# EAGLE design Main_Camera_Board7 (EAGLE 7.7.0)
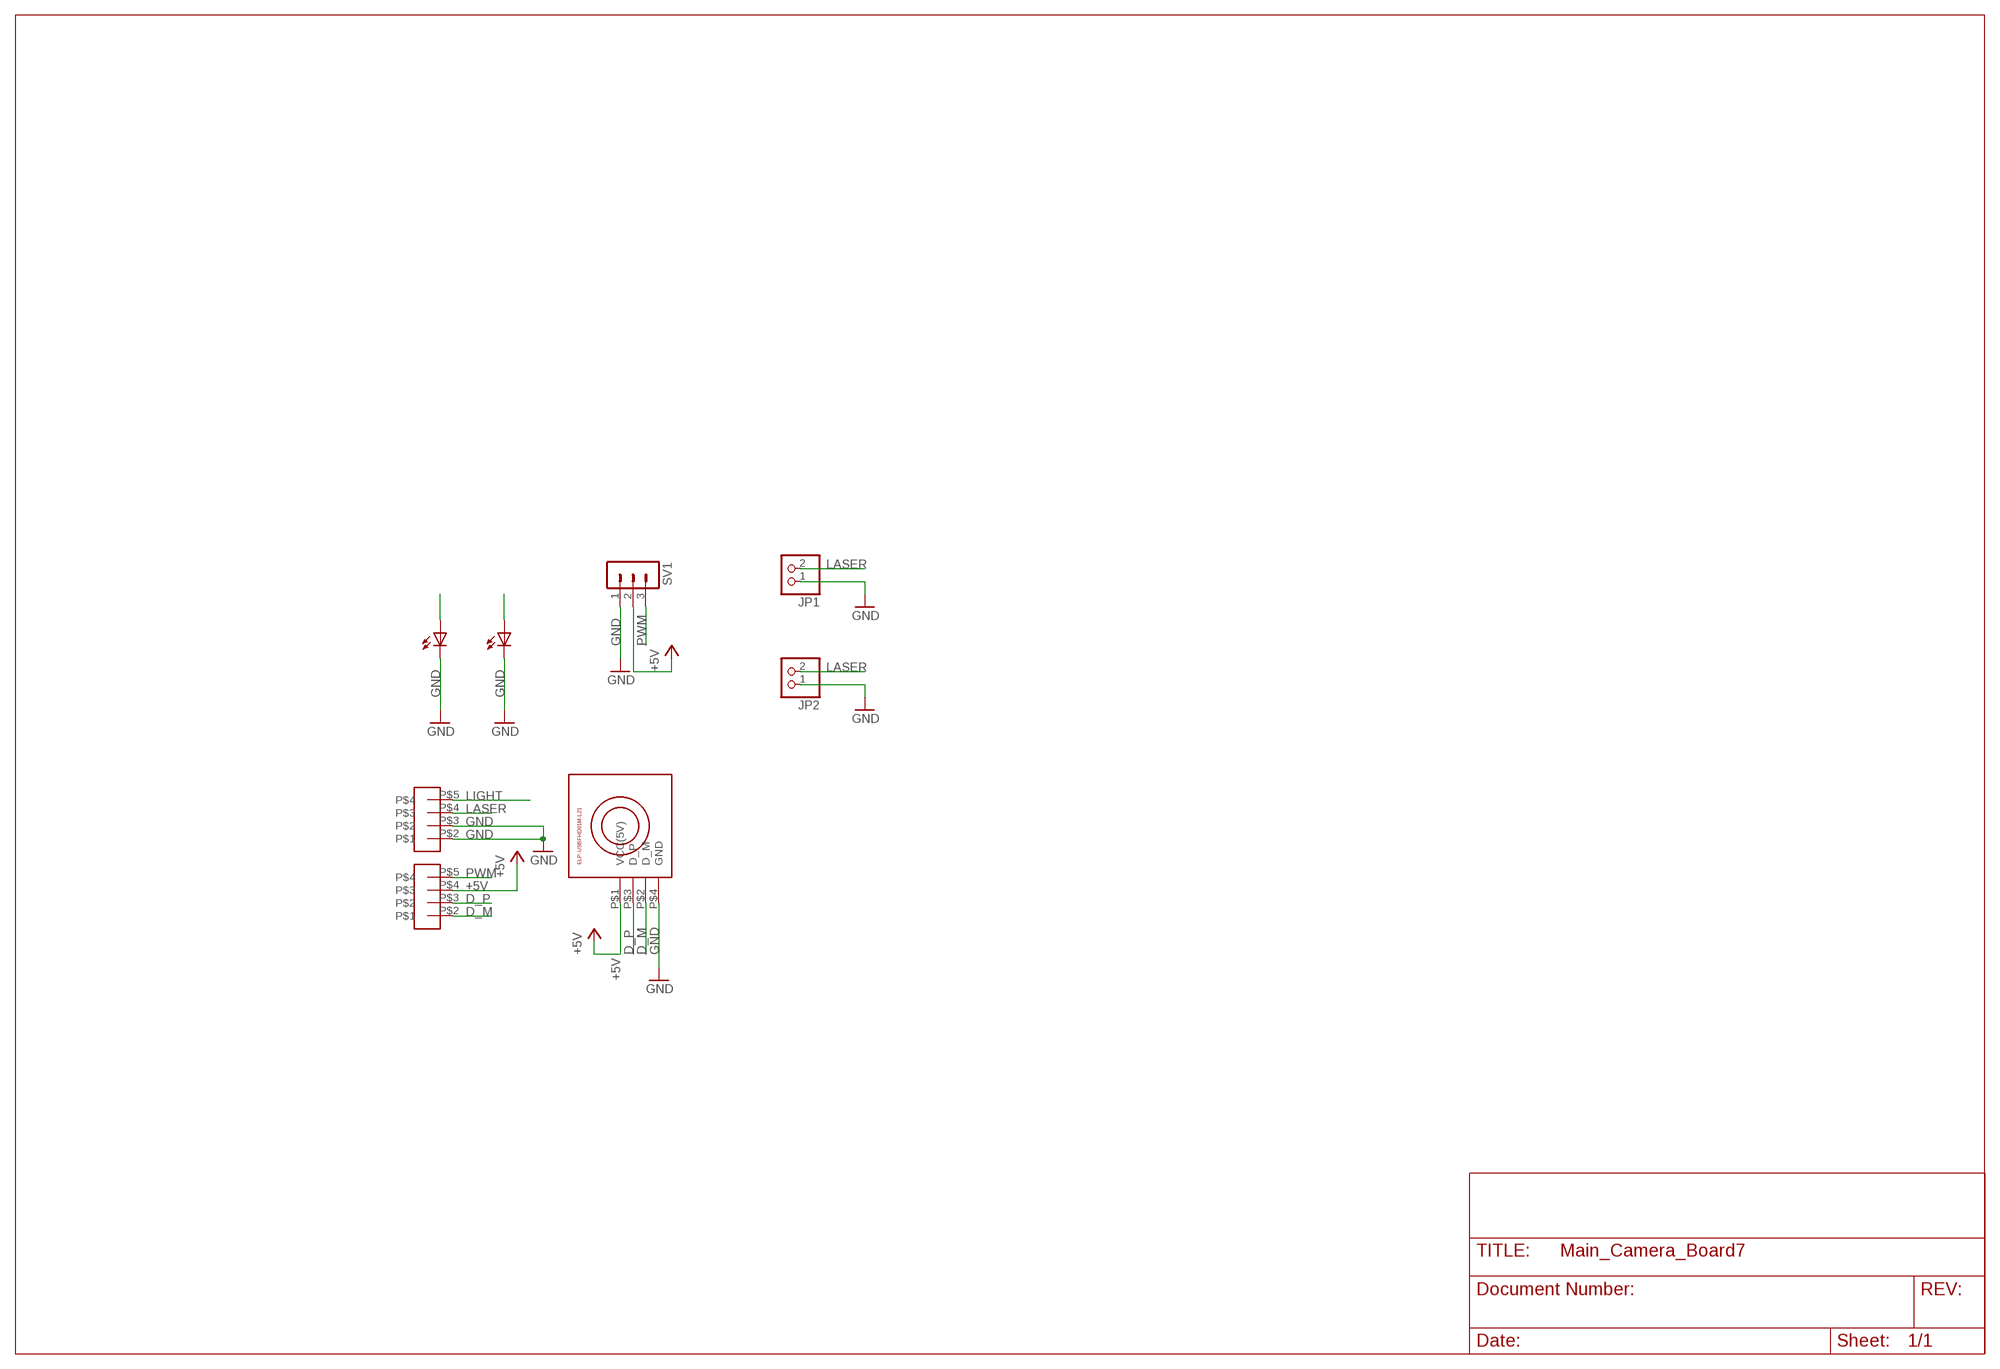
[diagram p0: schematic, sheet 1]

## Parts
JP1  PINHD-1X2  [1X02]
JP2  PINHD-1X2  [1X02]
SV1  MA03-1  [MA03-1]
U$1  ELP-USBFHD01M-L21  [ELP-USBFHD01M-L21]
U$2  LED  [LED]
U$3  LED  [LED]
U$4  T21  [T2I]
U$5  T21  [T2I]

## Nets
+5V: SV1.2 U$1.P$1(VCC(5V)) U$5.P$4
D_M: U$1.P$2(D_M) U$5.P$2
D_P: U$1.P$3(D_P) U$5.P$3
GND: JP1.1 JP2.1 SV1.1 U$1.P$4(GND) U$2.P$1(CATHODE) U$2.P$3(CATHODE) U$3.P$1(CATHODE) U$3.P$3(CATHODE) U$4.P$2 U$4.P$3
LASER: JP1.2 JP2.2 U$4.P$4
LIGHT: U$2.P$2(ANODE) U$3.P$2(ANODE) U$4.P$5
PWM: SV1.3 U$5.P$5

## Library data of the parts
JP1 JP2 = pinhead:PINHD-1X2: PIN HEADER
SV1 = con-lstb:MA03-1: PIN HEADER; OC_FARNELL: unknown; OC_NEWARK: unknown
U$1 = camera:ELP-USBFHD01M-L21
U$2 U$3 = camera:LED
U$4 U$5 = camera:T21

## Board
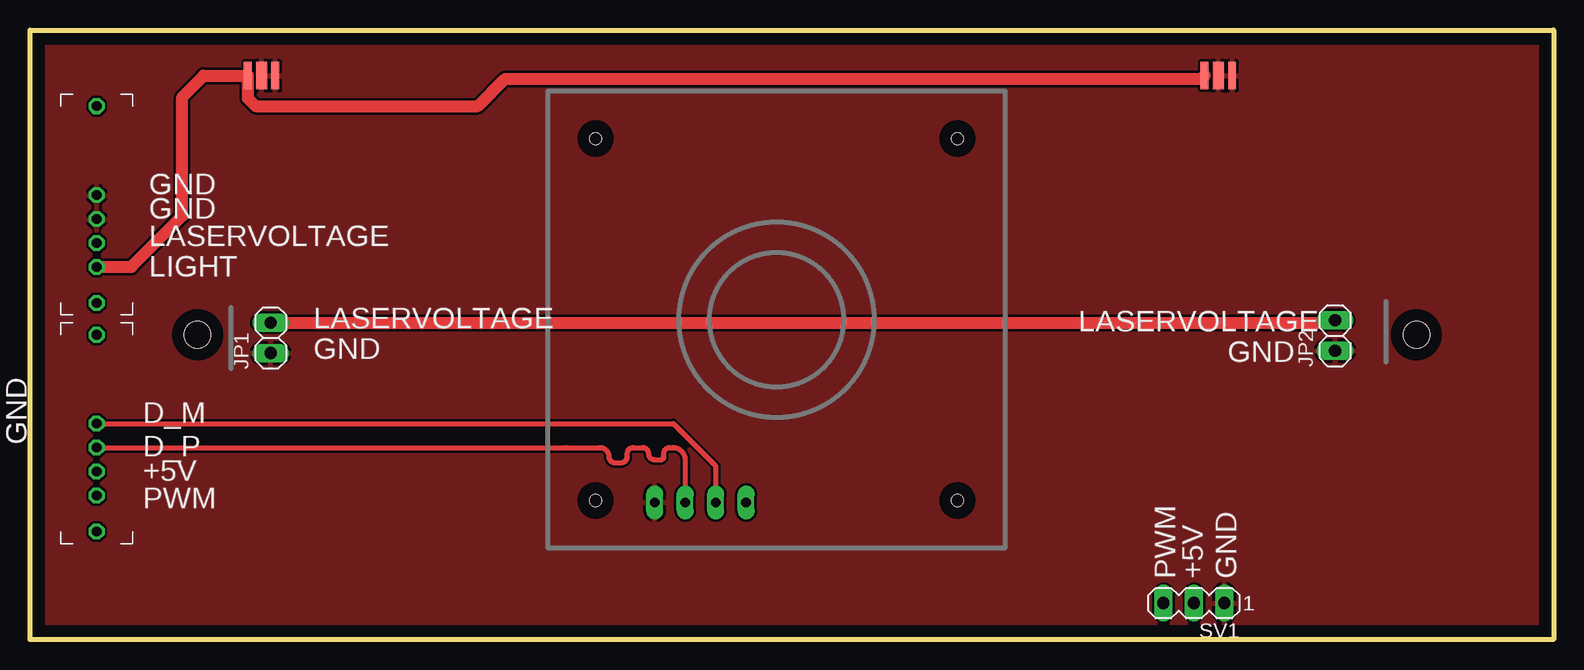
[diagram p1: board, top side]
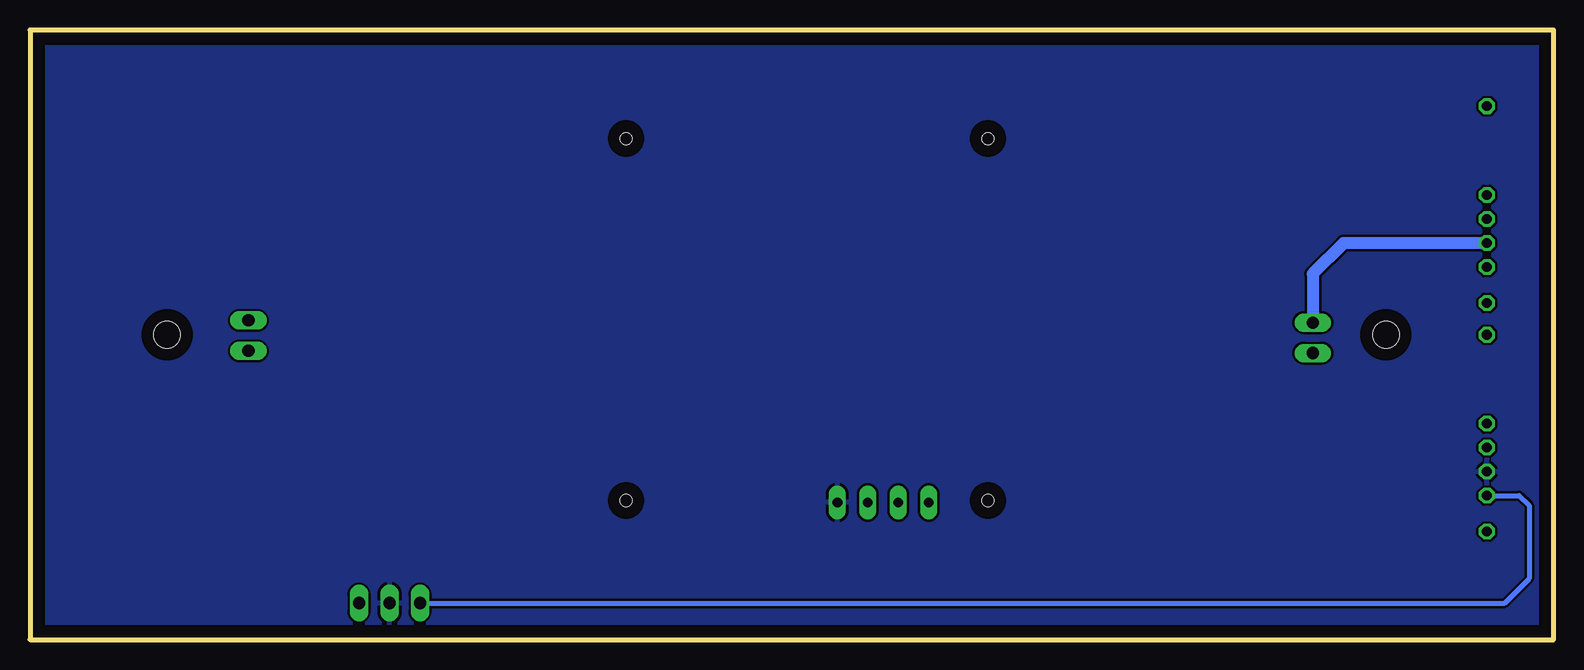
[diagram p2: board, bottom side, seen from below]

Size 127 x 50.8 mm. Coordinates in mm from the lower left corner, seen from the top.
Outline: 0,50.8 127,50.8 127,0 0,0 0,50.8
Copper layers (1*16): Top 0.035mm / dielectric 1.5mm / Bottom 0.035mm
Design rules "default": minimum track width 10mil, minimum drill 24mil, track to track 8mil, track to pad 8mil, pad to pad 8mil, via to via 8mil, smd to smd 8mil, copper to edge 40mil, drill to drill 8mil, minimum pad ring 10mil, minimum via ring 8mil, stop-mask expansion 4mil, vias tented up to drill 0mil, thermal gap 10mil
Holes 2.2 mm at 13.97,25.4 115.57,25.4

### Footprints (pad centres in the part's own frame; a part is rotated, then mirrored left to right if it is on the bottom)
1X02 = drill 1.016 long: 1 -1.27,0; 2 1.27,0
MA03-1 = drill 1.016 long: 1 -2.54,0; 2 0,0; 3 2.54,0
ELP-USBFHD01M-L21 = drill 0.8 pad 1.422 long: P$1 -2.54,-13.97; P$2 -5.08,-13.97; P$3 -7.62,-13.97; P$4 -10.16,-13.97 | hole 0.992: -15.081,16.351; 15.081,16.351; -15.081,-13.811; 15.081,-13.811
LED = smd 0.92 x 2.29: P$1 0,0 | smd 0.66 x 2.29: P$2 -1.15,0; P$3 1.15,0
T2I = drill 0.8 pad 1.27 octagon: P$1 0,0; P$2 7.4,0; P$3 9.4,0; P$4 11.4,0; P$5 13.4,0; P$6 16.4,0

### Placement (x,y rotation side)
JP1  20.07,25.15 90 top
JP2  108.8,25.34 90 top
SV1  97.03,3.05 180 top
U$1  62.23,25.4 0 top
U$2  19.3,46.99 0 top
U$3  99.06,46.99 0 top
U$4  5.56,44.45 270 top
U$5  5.56,25.4 270 top

### Tracks (layer width: path | path; a pad name or v marks a point on that pad's centre or on a via)
+5V
  pour Bottom: 0,0 127,0 127,50.8 0,50.8
D_M
  Top 0.406: U$5.P$2 53.63,18 57.15,14.48 U$1.P$2
D_P
  Top 0.406: U$5.P$3 44.7,16 47.5,16 arc-90 48.26,15.24 arc90 48.77,14.73 49.28,14.73 arc90 49.78,15.24 49.78,15.49 arc-90 50.29,16 51.05,16 arc-90 51.56,15.49 arc90 52.07,14.99 52.58,14.99 arc90 52.83,15.24 52.83,15.49 arc-90 53.34,16 53.59,16 arc-90 54.61,14.99 U$1.P$3
GND
  pour Top: 0,50.8 127,50.8 127,0 0,0
LASER
  Top 1.016: JP1.2 108.6,26.42 JP2.2
  Bottom 1.016: U$4.P$4 17.5,33.05 20.07,30.48 JP1.2
LIGHT
  Top 1.016: U$4.P$5 8.44,31.05 12.7,35.31 12.7,45.21 14.48,46.99 U$2.P$2 18.15,45.09 18.8,44.45 37.34,44.45 39.62,46.74 97.66,46.74 U$3.P$2
PWM
  Bottom 0.406: SV1.3 4.06,3.05 2.03,5.08 2.03,11.18 2.86,12 U$5.P$5

### Text on the board
tNames: GND | GND | LASERVOLTAGE | LIGHT | LASERVOLTAGE | LASERVOLTAGE | GND | GND | D_M | GND | D_P | +5V | PWM | PWM | +5V | GND
tDocu: 5 in x 2 in